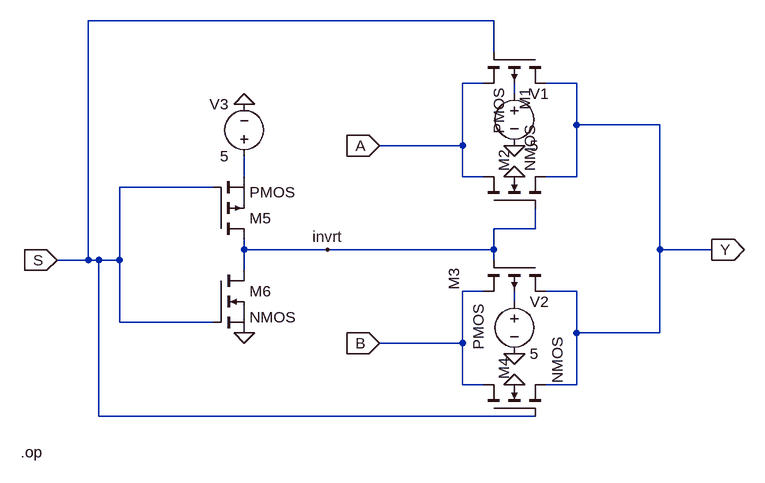
[diagram p0: schematic MUX_2input.asc]
MUX_2input.asc, the LTspice schematic file:
Version 4
SHEET 1 880 680
WIRE 32 -112 -592 -112
WIRE 32 -64 32 -112
WIRE 16 -16 -16 -16
WIRE 160 -16 112 -16
WIRE 64 0 64 -16
WIRE 160 48 160 -16
WIRE 288 48 160 48
WIRE -16 80 -16 -16
WIRE -16 80 -144 80
WIRE -352 128 -352 96
WIRE -16 128 -16 80
WIRE 16 128 -16 128
WIRE 160 128 160 48
WIRE 160 128 112 128
WIRE -400 144 -544 144
WIRE 96 208 96 176
WIRE 96 208 32 208
WIRE -352 240 -352 224
WIRE -224 240 -352 240
WIRE 32 240 32 208
WIRE 32 240 -224 240
WIRE 288 240 288 48
WIRE 368 240 288 240
WIRE -592 256 -592 -112
WIRE -592 256 -640 256
WIRE -576 256 -592 256
WIRE -544 256 -544 144
WIRE -544 256 -576 256
WIRE 32 256 32 240
WIRE -352 272 -352 240
WIRE 16 304 -16 304
WIRE 160 304 112 304
WIRE 64 320 64 304
WIRE -544 352 -544 256
WIRE -400 352 -544 352
WIRE 160 368 160 304
WIRE 288 368 288 240
WIRE 288 368 160 368
WIRE -16 384 -16 304
WIRE -16 384 -144 384
WIRE -16 448 -16 384
WIRE 16 448 -16 448
WIRE 160 448 160 368
WIRE 160 448 112 448
WIRE -576 496 -576 256
WIRE 96 496 -576 496
FLAG 64 80 0
FLAG 64 128 0
FLAG 64 400 0
FLAG 64 448 0
FLAG -352 16 0
FLAG -352 368 0
FLAG 368 240 Y
IOPIN 368 240 Out
FLAG -224 240 invrt
FLAG -640 256 S
IOPIN -640 256 In
FLAG -144 80 A
IOPIN -144 80 In
FLAG -144 384 B
IOPIN -144 384 In
SYMBOL pmos4 112 -64 R90
SYMATTR InstName M1
SYMBOL nmos4 16 176 R270
SYMATTR InstName M2
SYMBOL voltage 64 -16 R0
SYMATTR InstName V1
SYMATTR Value 5
SYMBOL pmos4 112 256 R90
WINDOW 0 13 141 Left 2
WINDOW 3 68 103 Left 2
SYMATTR InstName M3
SYMBOL nmos4 16 496 R270
WINDOW 3 50 114 Left 2
SYMATTR InstName M4
SYMBOL voltage 64 304 R0
SYMATTR InstName V2
SYMATTR Value 5
SYMBOL pmos -400 224 M180
SYMATTR InstName M5
SYMBOL nmos -400 272 R0
SYMATTR InstName M6
SYMBOL voltage -352 112 R180
WINDOW 0 24 96 Left 2
WINDOW 3 24 16 Left 2
SYMATTR InstName V3
SYMATTR Value 5
TEXT -696 552 Left 2 !.op

The netlist it stands for:
* MUX_2input.asc
M1 Y S A N001 PMOS
M2 A invrt Y 0 NMOS
V1 N001 0 5
M3 Y invrt B N003 PMOS
M4 B S Y 0 NMOS
V2 N003 0 5
M5 invrt S N002 N002 PMOS
M6 invrt S 0 0 NMOS
V3 N002 0 5
.model NMOS NMOS
.model PMOS PMOS
.lib standard.mos
.op
.backanno
.end